# Altium schematic sheet motordriver-v5.0_driver-power-stage.SchDoc
size A4; SheetNumber: 6; SheetTotal: 12
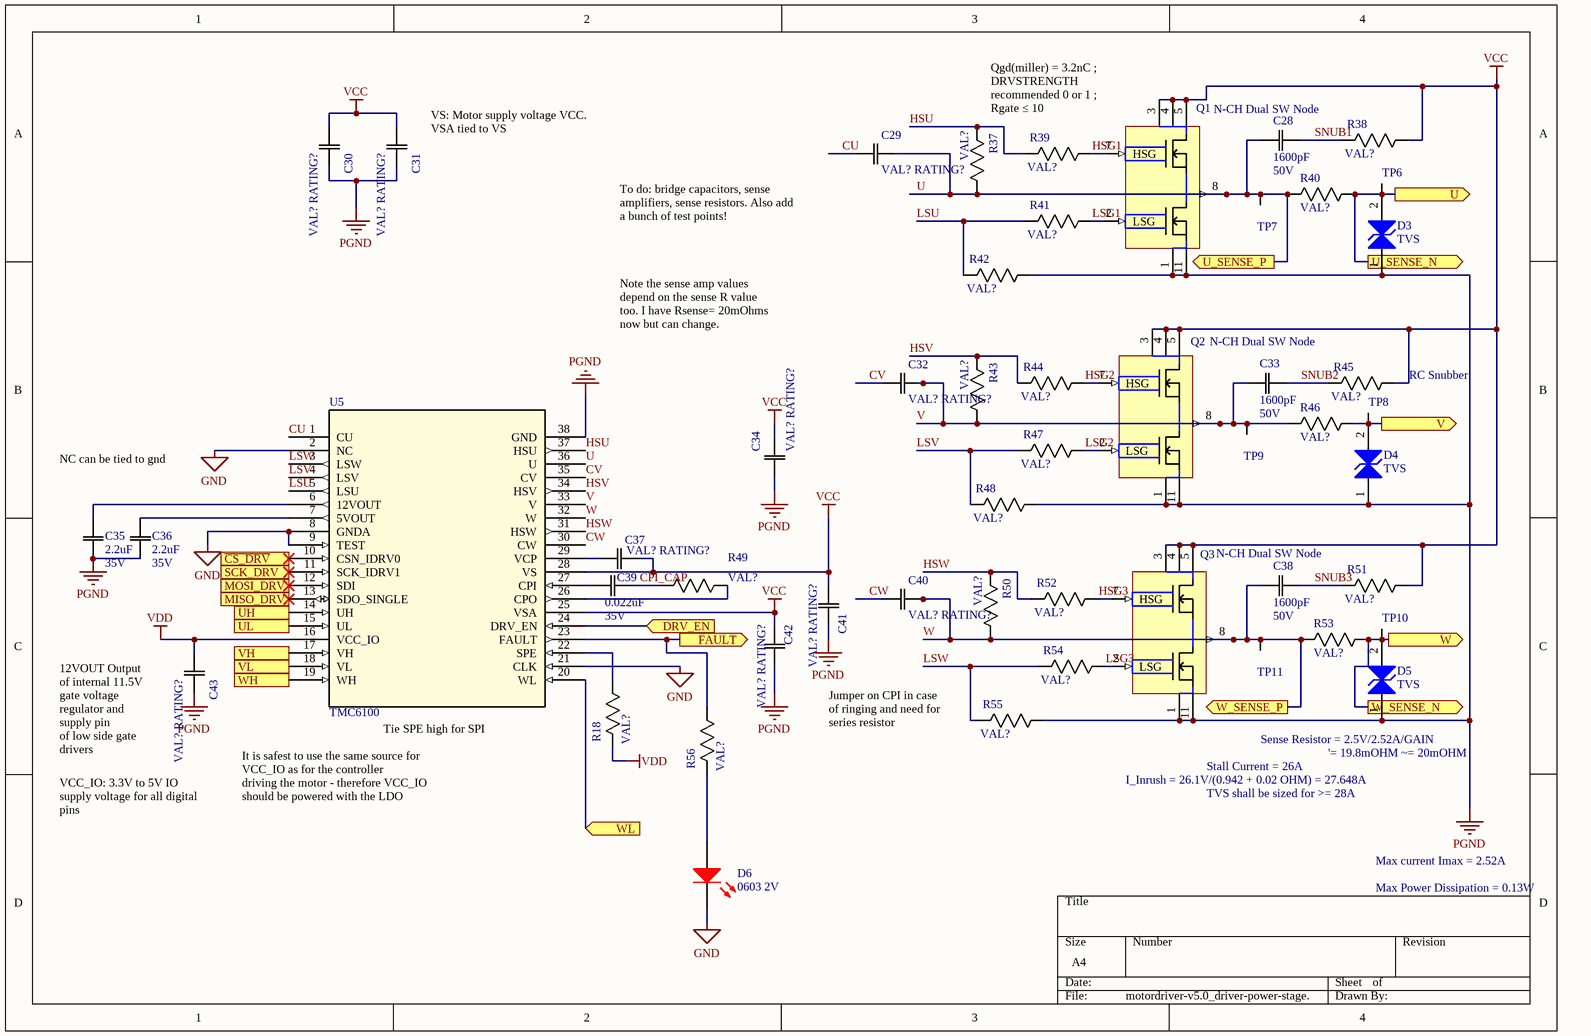
[diagram p0: motordriver-v5.0_driver-power-stage.SchDoc]

## Parts
C28  value 1600pF  Rating: 50V  [0603]  (hidden comment: VAL? RATING?)
C29  VAL? RATING?  [0603]
C30  VAL? RATING?  [0603]
C31  VAL? RATING?  [0805]
C32  VAL? RATING?  [0603]
C33  value 1600pF  Rating: 50V  [0603]  (hidden comment: VAL? RATING?)
C34  VAL? RATING?  [0805]
C35  value 2.2uF  Rating: 35V  [0603]  (hidden comment: VAL? RATING?)
C36  value 2.2uF  Rating: 35V  [0603]  (hidden comment: VAL? RATING?)
C37  VAL? RATING?  [0603]
C38  value 1600pF  Rating: 50V  [0603]  (hidden comment: VAL? RATING?)
C39  value 0.022uF  Rating: 35V  [0603]  (hidden comment: VAL? RATING?)
C40  VAL? RATING?  [0603]
C41  VAL? RATING?  [0603]
C42  VAL? RATING?  [0603]
C43  VAL? RATING?  [0603]
D3  TVS  [DO-214AC, SMA]
D4  TVS  [DO-214AC, SMA]
D5  TVS  [DO-214AC, SMA]
D6  0603 2V  [0603 - LED2]
Q1  N-CH Dual SW Node  [12-PowerWQFN]
Q2  N-CH Dual SW Node  [12-PowerWQFN]
Q3  N-CH Dual SW Node  [12-PowerWQFN]
R18  VAL?  [0603]
R37  VAL?  [0603]
R38  VAL?  [0603]
R39  VAL?  [0603]
R40  VAL?  [0603]
R41  VAL?  [0603]
R42  VAL?  [0603]
R43  VAL?  [0603]
R44  VAL?  [0603]
R45  VAL?  [0603]
R46  VAL?  [0603]
R47  VAL?  [0603]
R48  VAL?  [0603]
R49  VAL?  [0603]
R50  VAL?  [0603]
R51  VAL?  [0603]
R52  VAL?  [0603]
R53  VAL?  [0603]
R54  VAL?  [0603]
R55  VAL?  [0603]
R56  VAL?  [0603]
TP6  Test Point (Via)  [TP]  (value not drawn)
TP7  Test Point (Via)  [TP]  (value not drawn)
TP8  Test Point (Via)  [TP]  (value not drawn)
TP9  Test Point (Via)  [TP]  (value not drawn)
TP10  Test Point (Via)  [TP]  (value not drawn)
TP11  Test Point (Via)  [TP]  (value not drawn)
U5  TMC6100  [QFN50P700X700X85_HS-38N]

## Ports
DRV_EN (in), FAULT (out), MISO_DRV (out), MOSI_DRV (in), SCK_DRV (in), U (out), U_SENSE_N (out), U_SENSE_P (out), UH (in), UL (in), V (out), VH (in), VL (in), W (out), W_SENSE_N (out), W_SENSE_P (out), WH (in), WL (in), ~{CS_DRV} (in)

## Nets
GND: D6.2(K) U5.2(NC) U5.8(GNDA) U5.9(TEST) U5.21(CLK)
PGND: C30.2(C2) C31.2(C2) C34.1(C1) C35.1(C1) C36.1(C1) C41.2(C2) C42.2(C2) C43.2(C2) D3.1(K) D4.1(K) D5.1(K) Q1.1(GND) Q1.11(GND) Q2.1(GND) Q2.11(GND) Q3.1(GND) Q3.11(GND) R42.1(R1) R48.1(R1) R55.1(R1) U5.38(GND)
VCC: C30.1(C1) C31.1(C1) C34.2(C2) C37.2(C2) C41.1(C1) C42.1(C1) Q1.3(V+) Q1.4(V+) Q1.5(V+) Q2.3(V+) Q2.4(V+) Q2.5(V+) Q3.3(V+) Q3.4(V+) Q3.5(V+) R38.1(R1) R45.1(R1) R51.1(R1) U5.25(VSA) U5.28(VS)
VDD: C43.1(C1) R18.2(R2) U5.16(VCC_IO)
~{CS_DRV}: U5.10(CSN_IDRV0) ; port ~{CS_DRV}
CPI_CAP: C39.2(C2) R49.2(R2)
CU: C29.1(C1) U5.1(CU)
CV: C32.1(C1) U5.35(CV)
CW: C40.1(C1) U5.30(CW)
DRV_EN: U5.24(DRV_EN) ; port DRV_EN
FAULT: R56.1(R1) U5.23(FAULT) ; port FAULT
HSG1: Q1.7(HSG) R39.1(R1)
HSG2: Q2.7(HSG) R44.1(R1)
HSG3: Q3.7(HSG) R52.1(R1)
HSU: R37.2(R2) R39.2(R2) U5.37(HSU)
HSV: R43.2(R2) R44.2(R2) U5.34(HSV)
HSW: R50.2(R2) R52.2(R2) U5.31(HSW)
LSG1: Q1.2(LSG) R41.1(R1)
LSG2: Q2.2(LSG) R47.1(R1)
LSG3: Q3.2(LSG) R54.1(R1)
LSU: R41.2(R2) R42.2(R2) U5.5(LSU)
LSV: R47.2(R2) R48.2(R2) U5.4(LSV)
LSW: R54.2(R2) R55.2(R2) U5.3(LSW)
MISO_DRV: U5.13(SDO_SINGLE) ; port MISO_DRV
MOSI_DRV: U5.12(SDI) ; port MOSI_DRV
SCK_DRV: U5.11(SCK_IDRV1) ; port SCK_DRV
SNUB1: C28.1(C1) R38.2(R2)
SNUB2: C33.1(C1) R45.2(R2)
SNUB3: C38.1(C1) R51.2(R2)
U: C28.2(C2) C29.2(C2) Q1.8(SW) R37.1(R1) R40.2(R2) TP7.1 U5.36(U) ; port U_SENSE_P
U: D3.2(A) R40.1(R1) TP6.1 ; port U, port U_SENSE_N  [a separate net that carries the same name]
UH: U5.14(UH) ; port UH
UL: U5.15(UL) ; port UL
V: C32.2(C2) C33.2(C2) Q2.8(SW) R43.1(R1) R46.2(R2) TP9.1 U5.33(V)
V: D4.2(A) R46.1(R1) TP8.1 ; port V  [a separate net that carries the same name]
VH: U5.17(VH) ; port VH
VL: U5.18(VL) ; port VL
W: C38.2(C2) C40.2(C2) Q3.8(SW) R50.1(R1) R53.2(R2) TP11.1 U5.32(W) ; port W_SENSE_P
W: D5.2(A) R53.1(R1) TP10.1 ; port W, port W_SENSE_N  [a separate net that carries the same name]
WH: U5.19(WH) ; port WH
WL: U5.20(WL) ; port WL
NetC35_2: C35.2(C2) U5.6(12VOUT)
NetC36_2: C36.2(C2) U5.7(5VOUT)
NetC37_1: C37.1(C1) U5.29(VCP)
NetC39_1: C39.1(C1) U5.27(CPI)
NetD6_1: D6.1(A) R56.2(R2)
NetR18_1: R18.1(R1) U5.22(SPE)
NetR49_1: R49.1(R1) U5.26(CPO)

## Notes on the sheet
- Text
- (near Q1) Qgd(miller) = 3.2nC ; DRVSTRENGTH recommended 0 or 1 ; Rgate ≤ 10
- (near C31) VS: Motor supply voltage VCC. VSA tied to VS
- To do: bridge capacitors, sense amplifiers, sense resistors. Also add a bunch of test points!
- Note the sense amp values depend on the sense R value too. I have Rsense= 20mOhms now but can change.
- (near R45) RC Snubber
- NC can be tied to gnd
- (near C43) 12VOUT Output of internal 11.5V gate voltage regulator and supply pin
  of low side gate drivers
- Tie SPE high for SPI
- Jumper on CPI in case of ringing and need for series resistor
- I_Inrush = 26.1V/(0.942 + 0.02 OHM) = 27.648A
- Stall Current = 26A
- (near D5) Sense Resistor = 2.5V/2.52A/GAIN
- '= 19.8mOHM ~= 20mOHM
- VCC_IO: 3.3V to 5V IO supply voltage for all digital pins
- It is safest to use the same source for VCC_IO as for the controller
  driving the motor - therefore VCC_IO should be powered with the LDO
- TVS shall be sized for >= 28A
- Max current Imax = 2.52A
- Max Power Dissipation = 0.13W

## Library data of the parts
C28 C33 C38 = CAP 1600pF 50V: Default Symbol for Capacitors; Manufacturer Part Number 1: GRM1885C1H162JA01D; Tolerance: 5%; Temperature Coefficient: NP0; Part Number: CAP 1600pF 50V; Supplier 1: Digi-Key; Supplier Part Number 1: 490-1456-1-ND; Manufacturer Part Number 2: GRM2165C1H162JA01D; Supplier 2: Digi-Key; Supplier Part Number 2: 490-1625-1-ND
C29 C31 C32 C40 = CAP 470nF 50V: Default Symbol for Capacitors; Manufacturer Part Number 1: C1608X7R1H474K080AC; Value: 470nF; Tolerance: 10%; Rating: 50V; Temperature Coefficient: X7R; Part Number: CAP 470nF 50V; Supplier 1: Digi-Key; Supplier Part Number 1: 445-5952-1-ND; Manufacturer Part Number 2: CL21B474KBFNNNG; Supplier 2: Digi-Key; Supplier Part Number 2: 1276-6482-1-ND
C30 C37 C41-C43 = CAP 100nF 50V: Default Symbol for Capacitors; Manufacturer Part Number 1: CC0603KPX7R9BB104; Value: 100nF; Tolerance: 10%; Rating: 50V; Temperature Coefficient: X7R; Part Number: CAP 100nF 50V; Supplier 1: Digi-Key; Supplier Part Number 1: 311-3567-1-ND; Manufacturer Part Number 2: 0805J0500104KJT; Supplier 2: Digi-Key; Supplier Part Number 2: 1608-1458-1-ND
C34 = CAP 10uF 50V: Default Symbol for Capacitors; Manufacturer Part Number 1: GRM21BR61H106KE43L; Value: 10uF; Tolerance: 10%; Rating: 50V; Temperature Coefficient: X5R; Part Number: CAP 10uF 50V; Supplier 1: Digi-Key; Supplier Part Number 1: 490-18663-1-ND; Manufacturer Part Number 2: CL32B106KBJNNWE; Supplier 2: Digi-Key; Supplier Part Number 2: 1276-3388-1-ND
C35 C36 = CAP 2.2uF 35V: Default Symbol for Capacitors; Manufacturer Part Number 1: C1608X5R1V225K080AC; Tolerance: 10%; Temperature Coefficient: X5R; Part Number: CAP 2.2uF 35V; Supplier 1: Digi-Key; Supplier Part Number 1: 445-8025-1-ND; Manufacturer Part Number 2: CGA4J1X7R1V225K125AE; Supplier 2: Digi-Key; Supplier Part Number 2: 445-8787-1-ND
C39 = CAP 0.022uF 35V: Default Symbol for Capacitors; Manufacturer Part Number 1: GMK107BJ223KAHT; Tolerance: 10%; Temperature Coefficient: X7R; Part Number: CAP 0.022uF 35V; Supplier 1: Digi-Key; Supplier Part Number 1: 587-3359-1-ND; Manufacturer Part Number 2: GMK212SD223KG-T; Supplier 2: Digi-Key; Supplier Part Number 2: 587-1122-1-ND
D3-D5 = DIODE TVS 26VWM 53.5VC SMA: TVS DIODE 26V 53.5V SMA; Manufacturer Part Number: SMAJ26CA-TR; Power: 400W; Voltage Rating - DC: 26VWM, 53.5VC; Current Rating: 43A; Supplier 1: Digi-Key; Supplier Part Number 1: 497-12523-1-ND; Part Number: DIODE TVS 26VWM 53.5VC SMA; Supplier URL 1: https://www.digikey.ca/en/products/detail/stmicroelectronics/SMAJ26CA-TR/2214530?s=N4IgTCBcDaICwE4DsBaAjGArGAzOlAcgCIgC6AvkA; Pin Count: 2
D6 = LED RED SMD 0603: 0603 red led alingap 631nm-639nm water clear 18-180mcd 130d; Manufacturer Part Number: LTST-C190KRKT; Current Rating: 20mA; Supplier 1: Digi-Key; Supplier Part Number 1: 160-1436-1-ND; Part Number: LED RED SMD 0603; Supplier URL 1: https://www.digikey.ca/en/products/detail/lite-on-inc/LTST-C190KRKT/386817?s=N4IgTCBcDaIIwDYAMBaOAWAzAtKByAIiALoC%2BQA; Pin Count: 2; Voltage Rating - DC: 2V
Q1-Q3 = MOSFET N-CH DUAL NTTFD4D0N04HLTWG: MOSFET N+N COMMON PHASE SW 40V 60A; Manufacturer: ON Semiconductor; Supplier 1: Digi-Key; Manufacturer Part Number: NTTFD4D0N04HLTWG; RoHS: Yes; Category: MOSFETs; Stock 1: 3000; Pricing 1: 1=1.51000, 10=1.34800, 100=1.05120, 500=0.86840, 1000=0.72712 (USD); Supplier Part Number 1: 488-NTTFD4D0N04HLTWGCT-ND
R18 = RES 4.7k 1/8W - 5%: Default Resistor Symbol; Value: 1; Power (Watts): 0.125W; Tolerance: 5%; Package: 0805; Part Number: RES 4.7k 1/8W - 5%
R37 R42 R43 R48 R50 R55 = RES 100k 1/8W: Default Resistor Symbol; Manufacturer Part Number 1: ERJ-H3GJ104V; Value: 100k; Power (Watts): 0.125W; Tolerance: 5%; Tolerance 2: 1%; Package: 0805; Part Number: RES 100k 1/8W; Supplier 1: Digi-Key; Supplier Part Number 1: 10-ERJ-H3GJ104VCT-ND; Manufacturer Part Number 2: RMCF0805FT100K; Supplier 2: Digi-Key; Supplier Part Number 2: RMCF0805FT100KCT-ND
R38 R39 R41 R44 R45 R47 R51 R52 R54 = RES 10.0 1/8W - 1%: Default Resistor Symbol; Manufacturer Part Number 1: RNCP0603FTD10R0; Value: 10; Power (Watts): 0.125W; Tolerance: 1%; Package: 0805; Part Number: RES 10.0 1/8W - 1%; Supplier 1: Digi-Key; Supplier Part Number 1: RNCP0603FTD10R0CT-ND; Manufacturer Part Number 2: RNCP0603FTD10R0; Supplier 2: Digi-Key; Supplier Part Number 2: RNCP0603FTD10R0CT-ND; Tolerance 2: 1%
R40 R46 R53 = RES 10m 1W: Default Resistor Symbol; Manufacturer Part Number 1: CSRL1-0R01F8; Value: 10m; Power (Watts): 0.125W; Tolerance: 1%; Package: 0805; Part Number: RES 10m 1W; Supplier 1: Digi-Key; Supplier Part Number 1: 696-1845-1-ND
R49 = RES 0 JUMPER: Default Resistor Symbol; Value: 1; Power (Watts): 0.125W; Tolerance: 5%; Package: 0805; Part Number: RES 0 JUMPER
R56 = RES 75.0 1/8W - 5%: Default Resistor Symbol; Manufacturer Part Number 1: RMCF0805JT75R0; Value: 75; Power (Watts): 0.125W; Tolerance: 5%; Tolerance 2: 1%; Package: 0805; Part Number: RES 75.0 1/8W - 5%; Supplier 1: Digi-Key; Supplier Part Number 1: RMCF0805JT75R0CT-ND; Manufacturer Part Number 2: RNCP0603FTD75R0; Supplier 2: Digi-Key; Supplier Part Number 2: RNCP0603FTD75R0CT-ND
U5 = TMC6100: GATE DRIVER IC 8-60V QFN37; Manufacturer Part Number: TMC6100-LA; Supplier 1: Newark; Supplier Part Number 1: 54AH1603; Part Number: TMC6100; Suppler URL 1: https://canada.newark.com/trinamic/tmc6100-la/motor-driver-40-to-125deg-c-rohs/dp/54AH1603?ost=54ah1603
TP6-TP11 = Test Point (Via): Part Number: Test Point (Via)